# EAGLE schematic MyRelay (EAGLE 6.6.0)
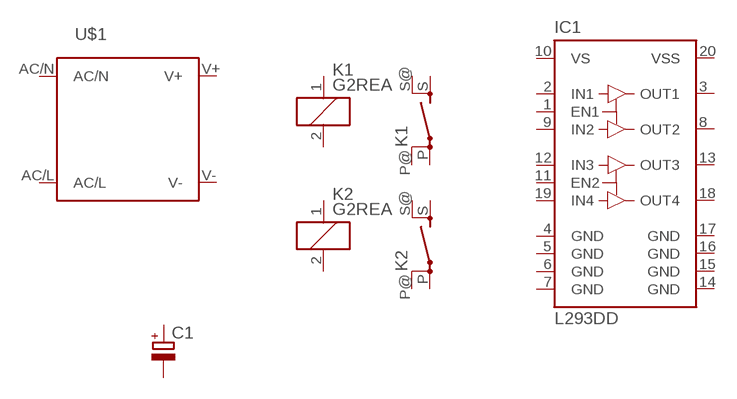
[diagram p0: schematic, sheet 1]

## Parts
C1  CPOL-EUE5-13  [E5-13]
IC1  L293DD  [SO20]
K1  G2REA  [G2REA]
K2  G2REA  [G2REA]
U$1  IRM_01/02_SMDIRM_01/02_SMD  [IRM_01/02_SMD]
Unconnected: C1.+ C1.- IC1.1(EN1) IC1.2(IN1) IC1.3(OUT1) IC1.8(OUT2) IC1.9(IN2) IC1.11(EN2) IC1.12(IN3) IC1.13(OUT3) IC1.18(OUT4) IC1.19(IN4) K1.1 K1.2 K1.P(2:P) K1.P@(2:P) K1.S(2:S) K1.S@(2:S) K2.1 K2.2 K2.P(2:P) K2.P@(2:P) K2.S(2:S) K2.S@(2:S) U$1.AC/L U$1.AC/N U$1.V+ U$1.V-

## Power pins joined to a net without a drawn wire
GND: IC1.4(GND) IC1.5(GND) IC1.6(GND) IC1.7(GND) IC1.14(GND) IC1.15(GND) IC1.16(GND) IC1.17(GND)
VS: IC1.10(VS)
VSS: IC1.20(VSS)

## Library data of the parts
C1 = rcl:CPOL-EU: POLARIZED CAPACITOR, European symbol
IC1 = st-microelectronics:L293DD: PUSH-PULL FOUR CHANNEL DRIVER WITH DIODES Source: http://www.st.com/stonline/books/pdf/docs/1330.pdf; OC_FARNELL: unknown
K1 K2 = relay:G2REA: RELAY 1 x norm. open, high current, Omron; OC_FARNELL: unknown; OC_NEWARK: unknown
U$1 = meanwell_irm_v7:IRM_01/02_SMD: 1 or 2 watt housing & pin compatible IRM 01 Vout [V] Imax [A] Pmax [W] Eff [%] 3.3 0.3 1 66 5 0.2 1 70 9 0.111 1 72 12 0.083 1 74 15 0.067 1 75 24 0.042 1 77 IRM 2 Vout [V] Imax [A] Pmax [W] Eff [%] 3.3 0.6 2 66 5 0.4 2 70 9 0.222 2 72 12 0.167 2 74 15 0.133 2 75 24 0.087 2 77